# EAGLE design LDAQ-MOD-IO40 (EAGLE 6.6.0)
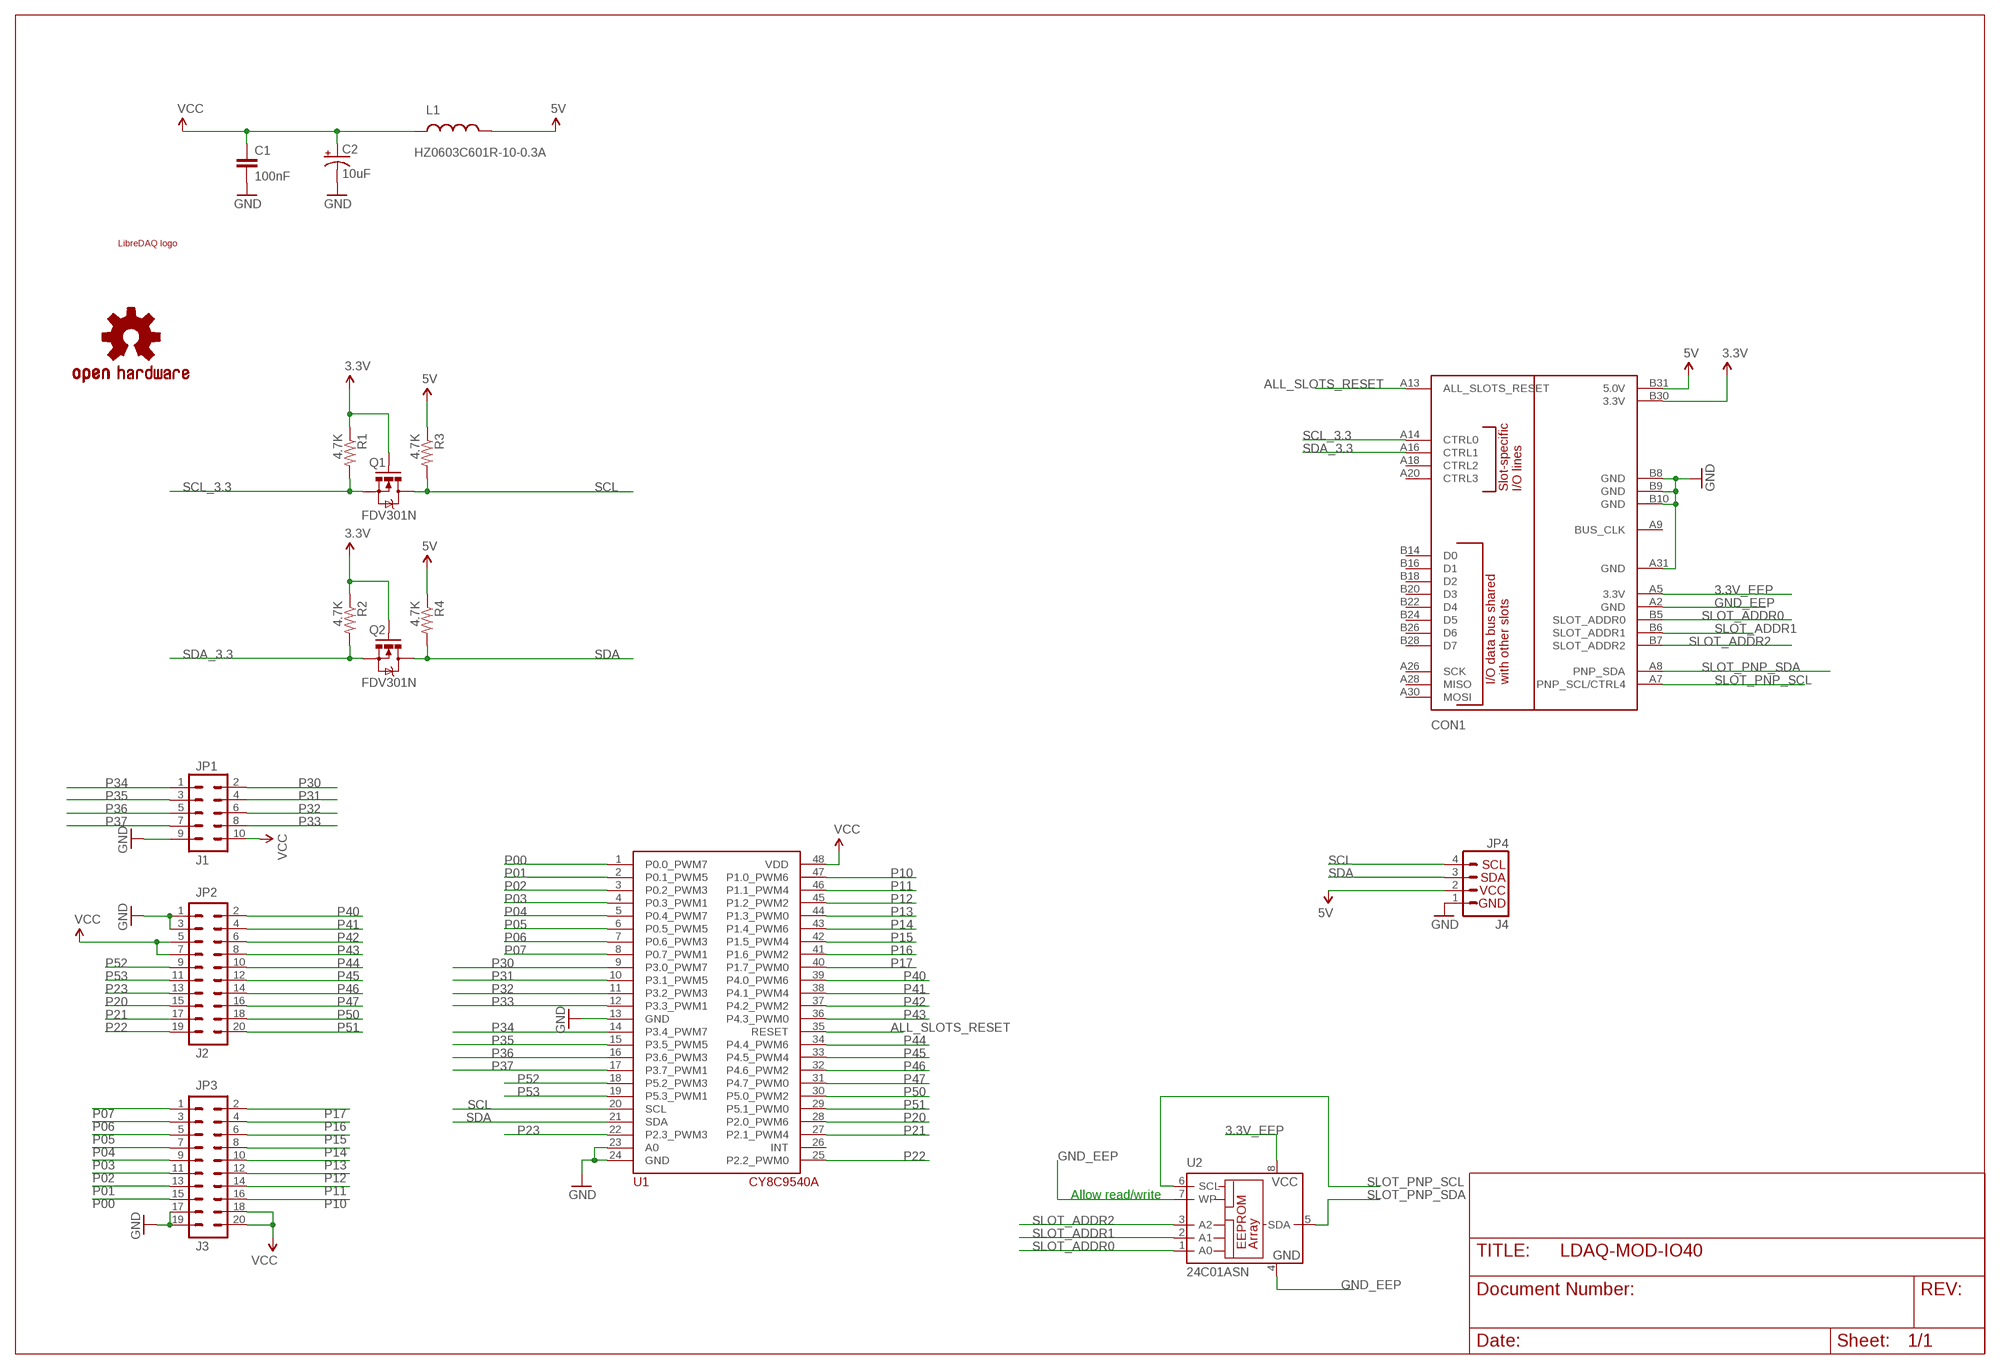
[diagram p0: schematic, sheet 1]

## Parts
C1  100nF  CAP0603-CAP  [0603-CAP]
C2  10uF  CAP_POL1206  [EIA3216]
CON1  C1  LIBREDAQ_DAUGHTER_BOARDPCI-64-SIZE1-PADS  [PCI-E_64_EDGE_70X60_PADS-ONLY]
JP1  J1  M05X2SHD  [2X5-SHROUDED]
JP2  J2  M10X22X10-SHROUDED  [2X10-SHROUDED]
JP3  J3  M10X22X10-SHROUDED  [2X10-SHROUDED]
JP4  J4  I2C_STANDARD  [1X04]
L1  HZ0603C601R-10-0.3A  INDUCTOR0603  [0603]
LOGO1  LIBREDAQ_LOGO_MINILOGO_GENERIC  [LIBREDAQ_LOGO]
LOGO2  OSHW-LOGOM  [OSHW-LOGO-M]
Q1  FDV301N  MOSFET-NCHANNELSMD  [SOT23-3]
Q2  FDV301N  MOSFET-NCHANNELSMD  [SOT23-3]
R1  4.7K  RESISTOR0603-RES  [0603-RES]
R2  4.7K  RESISTOR0603-RES  [0603-RES]
R3  4.7K  RESISTOR0603-RES  [0603-RES]
R4  4.7K  RESISTOR0603-RES  [0603-RES]
U1  CY8C9540A  [SSOP-48]
U2  24C01ASN  [SO-08]

## Nets
3.3V: CON1.B30(3.3V) Q1.1(G) Q2.1(G) R1.1 R2.1
3.3V_EEP: CON1.A5(3.3V) U2.8(VCC)
5V: CON1.B31(5.0V) JP4.2 L1.2 R3.1 R4.1
ALL_SLOTS_RESET: CON1.A13(ALL_SLOTS_RESET) U1.35(RESET)
GND: C1.2 C2.C(-) CON1.A31(GND) CON1.B8(GND) CON1.B9(GND) CON1.B10(GND) JP1.9 JP2.1 JP2.3 JP3.17 JP3.19 JP4.1 U1.13(GND) U1.23(A0) U1.24(GND)
GND_EEP: CON1.A2(GND) U2.4(GND) U2.7(WP)
P00: JP3.15 U1.1(P0.0_PWM7)
P01: JP3.13 U1.2(P0.1_PWM5)
P02: JP3.11 U1.3(P0.2_PWM3)
P03: JP3.9 U1.4(P0.3_PWM1)
P04: JP3.7 U1.5(P0.4_PWM7)
P05: JP3.5 U1.6(P0.5_PWM5)
P06: JP3.3 U1.7(P0.6_PWM3)
P07: JP3.1 U1.8(P0.7_PWM1)
P10: JP3.16 U1.47(P1.0_PWM6)
P11: JP3.14 U1.46(P1.1_PWM4)
P12: JP3.12 U1.45(P1.2_PWM2)
P13: JP3.10 U1.44(P1.3_PWM0)
P14: JP3.8 U1.43(P1.4_PWM6)
P15: JP3.6 U1.42(P1.5_PWM4)
P16: JP3.4 U1.41(P1.6_PWM2)
P17: JP3.2 U1.40(P1.7_PWM0)
P20: JP2.15 U1.28(P2.0_PWM6)
P21: JP2.17 U1.27(P2.1_PWM4)
P22: JP2.19 U1.25(P2.2_PWM0)
P23: JP2.13 U1.22(P2.3_PWM3)
P30: JP1.2 U1.9(P3.0_PWM7)
P31: JP1.4 U1.10(P3.1_PWM5)
P32: JP1.6 U1.11(P3.2_PWM3)
P33: JP1.8 U1.12(P3.3_PWM1)
P34: JP1.1 U1.14(P3.4_PWM7)
P35: JP1.3 U1.15(P3.5_PWM5)
P36: JP1.5 U1.16(P3.6_PWM3)
P37: JP1.7 U1.17(P3.7_PWM1)
P40: JP2.2 U1.39(P4.0_PWM6)
P41: JP2.4 U1.38(P4.1_PWM4)
P42: JP2.6 U1.37(P4.2_PWM2)
P43: JP2.8 U1.36(P4.3_PWM0)
P44: JP2.10 U1.34(P4.4_PWM6)
P45: JP2.12 U1.33(P4.5_PWM4)
P46: JP2.14 U1.32(P4.6_PWM2)
P47: JP2.16 U1.31(P4.7_PWM0)
P50: JP2.18 U1.30(P5.0_PWM2)
P51: JP2.20 U1.29(P5.1_PWM0)
P52: JP2.9 U1.18(P5.2_PWM3)
P53: JP2.11 U1.19(P5.3_PWM1)
SCL: JP4.4 Q1.3(D) R3.2 U1.20(SCL)
SCL_3.3: CON1.A14(CTRL0) Q1.2(S) R1.2
SDA: JP4.3 Q2.3(D) R4.2 U1.21(SDA)
SDA_3.3: CON1.A16(CTRL1) Q2.2(S) R2.2
SLOT_ADDR0: CON1.B5(SLOT_ADDR0) U2.1(A0)
SLOT_ADDR1: CON1.B6(SLOT_ADDR1) U2.2(A1)
SLOT_ADDR2: CON1.B7(SLOT_ADDR2) U2.3(A2)
SLOT_PNP_SCL: CON1.A7(PNP_SCL/CTRL4) U2.6(SCL)
SLOT_PNP_SDA: CON1.A8(PNP_SDA) U2.5(SDA)
VCC: C1.1 C2.A(+) JP1.10 JP2.5 JP2.7 JP3.18 JP3.20 L1.1 U1.48(VDD)
Unconnected: CON1.A9(BUS_CLK) CON1.A18(CTRL2) CON1.A20(CTRL3) CON1.A26(SCK) CON1.A28(MISO) CON1.A30(MOSI) CON1.B14(D0) CON1.B16(D1) CON1.B18(D2) CON1.B20(D3) CON1.B22(D4) CON1.B24(D5) CON1.B26(D6) CON1.B28(D7) U1.26(INT)

## Notes on the sheet
- Allow read/write

## Library data of the parts
C1 = SparkFun-Passives:CAP: Capacitor Standard 0603 ceramic capacitor, and 0.1" leaded capacitor.
C2 = SparkFun-Capacitors:CAP_POL: Capacitor Polarized These are standard SMD and PTH capacitors. Normally 10uF, 47uF, and 100uF in electrolytic and tantalum varieties. Always verify the external diameter of the through hole cap, it varies with capacity, voltage, and manufacturer. The EIA devices should be standard.
CON1 = libredaq-comps:LIBREDAQ_DAUGHTER_BOARD: LibreDAQ Expansion board (PCI-E form)
JP1 = libredaq-comps:M05X2: Header 5x2 Standard 10-pin dual row 0.1" header. Commonly used with AVR-ISP. Use with Spark Fun Electronics SKU: PRT-00778
JP2 JP3 = libredaq-comps:M10X2: This was SPECIALLY designed to be used with our Graphic LCD Backpack. Be sure you want to use this! It is not only staggered on each line of header holes, but IT IS ALSO offset of the center point of the top and bottom lines by 5 mil. This causes the headers to lock into place on the "standard" footprint on the LCD screen. The extra squares on the tdocu layer are there simply to reference other pins (if you were to actually populate a longer header than ten long - this is what we do with the backpacks).
JP4 = SparkFun-Connectors:I2C_STANDARD: SparkFun has standardized on a pinout for all I2C based sensor breakouts. This pinout allows I2C boards to be plugged directly into the headers on Arduino Uno compatible boards, and to be daisy chained easily.
L1 = SparkFun-Passives:INDUCTOR: Inductors Basic Inductor/Choke - 0603 and 1206. Footprints are not proven and vary greatly between part numbers. SRN6045- 33uH, 20% 1.4A SDR0403-560KL - 56uH, 10%, 500mA RMS/740mA peak
LOGO1 = libredaq-comps:LIBREDAQ_LOGO_MINI
LOGO2 = SparkFun-Aesthetics:OSHW-LOGO: Open Source Hardware Logo This logo indicates the piece of hardware it is found on incorporates a OSHW license and/or adheres to the definition of open source hardware found here: http://freedomdefined.org/OSHW
Q1 Q2 = SparkFun:MOSFET-NCHANNEL
R1-R4 = SparkFun:RESISTOR: Resistor Basic schematic elements and footprints for 0603, 1206, and PTH resistors.
U1 = libredaq-comps:CY8C9540A: The CY8C95xxA is a multi-port I/O expander with on board user available EEPROM and several PWM outputs. All devices in this family operate identically but differ in I/O pins, number of PWMs, and internal EEPROM size.
U2 = libredaq-comps:24C*: Serial EEPROM 1 K/2 K/4 K; MPN: AT24C01BN-SH-B; OC_FARNELL: 1362638; OC_NEWARK: 50M3313

## Board
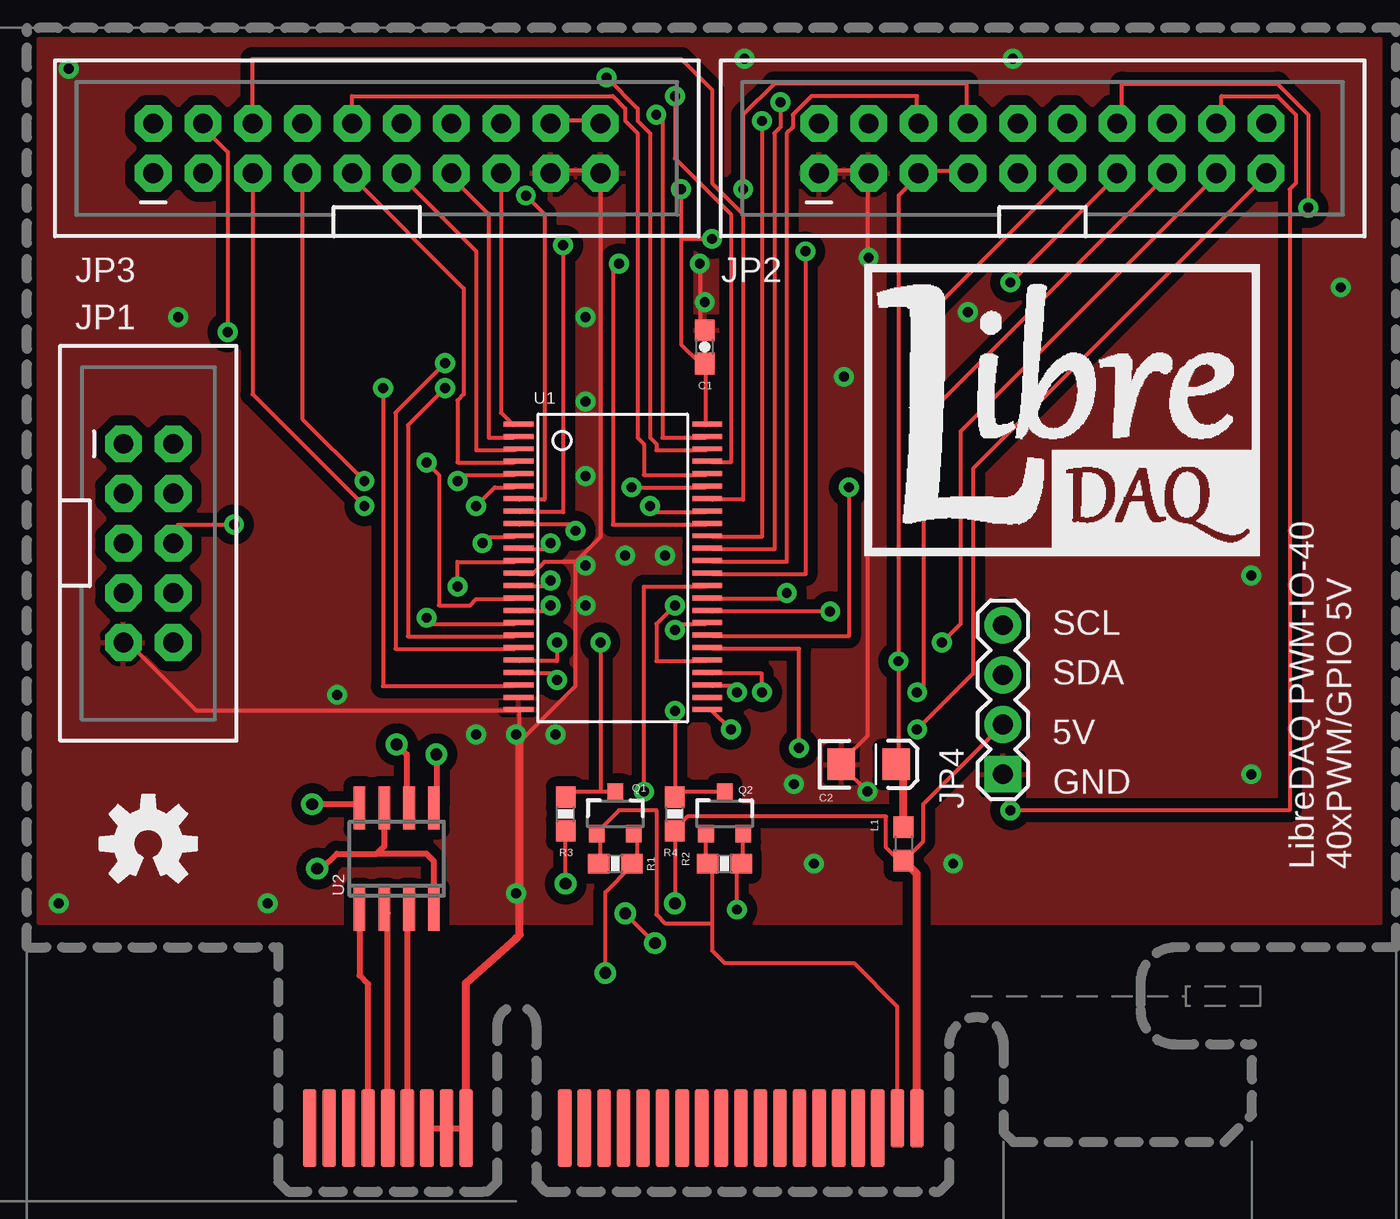
[diagram p1: board, top side]
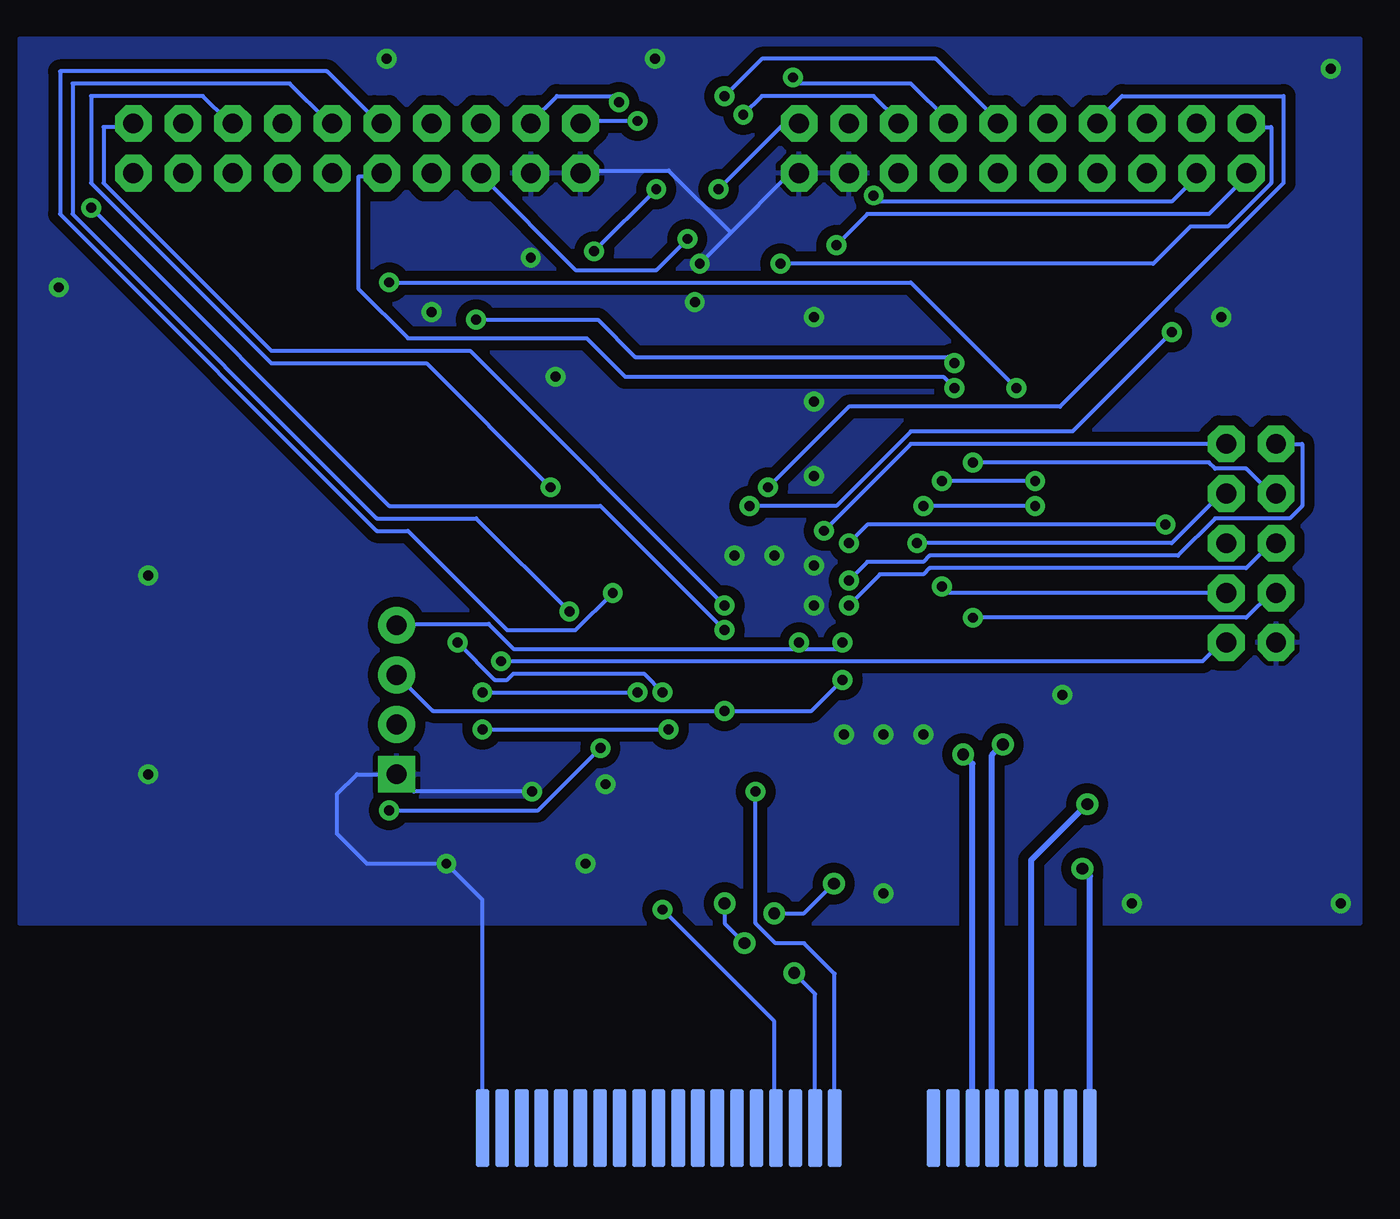
[diagram p2: board, bottom side, seen from below]

No outline drawn. Coordinates in mm, seen from the top.
Copper layers (1*16): Top 0.035mm / dielectric 1.5mm / Bottom 0.035mm
Design rules "LibreDAQ": minimum track width 8mil, minimum drill 20mil, track to track 8mil, track to pad 7mil, pad to pad 7mil, via to via 8mil, smd to smd 7mil, copper to edge 6mil, drill to drill 8mil, minimum pad ring 12mil, minimum via ring 10mil, stop-mask expansion 4mil, vias tented up to drill 25mil, thermal gap 10mil

### Footprints (pad centres in the part's own frame; a part is rotated, then mirrored left to right if it is on the bottom)
0603-CAP = smd 1.1 x 1: 1 -0.85,0; 2 0.85,0
EIA3216 = smd 1.4 x 1.6: A 1.4,0; C -1.4,0
PCI-E_64_EDGE_70X60_PADS-ONLY = smd 0.7 x 4 bottom: A2 -10.55,3.75; A3 -9.55,3.75; A4 -8.55,3.75; A5 -7.55,3.75; A6 -6.55,3.75; A7 -5.55,3.75; A8 -4.55,3.75; A9 -3.55,3.75; A10 -2.55,3.75; A13 2.5,3.75; A14 3.5,3.75; A15 4.5,3.75; A16 5.5,3.75; A17 6.5,3.75; A18 7.5,3.75; A19 8.5,3.75; A20 9.5,3.75; A21 10.5,3.75; A22 11.5,3.75; A23 12.5,3.75; A24 13.5,3.75; A25 14.5,3.75; A26 15.5,3.75; A27 16.5,3.75; A28 17.5,3.75; A29 18.5,3.75; A30 19.5,3.75; A31 20.5,3.75 | smd 0.7 x 4: B2 -10.55,3.75; B3 -9.55,3.75; B4 -8.55,3.75; B5 -7.55,3.75; B6 -6.55,3.75; B7 -5.55,3.75; B8 -4.55,3.75; B9 -3.55,3.75; B10 -2.55,3.75; B13 2.5,3.75; B14 3.5,3.75; B15 4.5,3.75; B16 5.5,3.75; B17 6.5,3.75; B18 7.5,3.75; B19 8.5,3.75; B20 9.5,3.75; B21 10.5,3.75; B22 11.5,3.75; B23 12.5,3.75; B24 13.5,3.75; B25 14.5,3.75; B26 15.5,3.75; B27 16.5,3.75; B28 17.5,3.75; B29 18.5,3.75 | smd 0.7 x 3: B30 19.5,4.25; B31 20.5,4.25
2X5-SHROUDED = drill 1.016 pad 1.88 octagon: 1 -1.27,5.08; 2 1.27,5.08; 3 -1.27,2.54; 4 1.27,2.54; 5 -1.27,0; 6 1.27,0; 7 -1.27,-2.54; 8 1.27,-2.54; 9 -1.27,-5.08; 10 1.27,-5.08
2X10-SHROUDED = drill 1.016 pad 1.88 octagon: 1 -1.27,11.43; 2 1.27,11.43; 3 -1.27,8.89; 4 1.27,8.89; 5 -1.27,6.35; 6 1.27,6.35; 7 -1.27,3.81; 8 1.27,3.81; 9 -1.27,1.27; 10 1.27,1.27; 11 -1.27,-1.27; 12 1.27,-1.27; 13 -1.27,-3.81; 14 1.27,-3.81; 15 -1.27,-6.35; 16 1.27,-6.35; 17 -1.27,-8.89; 18 1.27,-8.89; 19 -1.27,-11.43; 20 1.27,-11.43
1X04 = drill 1.016 pad 1.88 square: 1 0,0 | drill 1.016 pad 1.88: 2 2.54,0; 3 5.08,0; 4 7.62,0
0603 = smd 1.1 x 1: 1 -0.85,0; 2 0.85,0
SOT23-3 = smd 0.8 x 0.9: 1 -0.95,-1; 2 0.95,-1; 3 0,1.1
0603-RES = smd 1.1 x 1: 1 -0.85,0; 2 0.85,0
SSOP-48 = smd 0.254 x 1.524: 1 0,-4.826; 2 0.635,-4.826; 3 1.27,-4.826; 4 1.905,-4.826; 5 2.54,-4.826; 6 3.175,-4.826; 7 3.81,-4.826; 8 4.445,-4.826; 9 5.08,-4.826; 10 5.715,-4.826; 11 6.35,-4.826; 12 6.985,-4.826; 13 7.62,-4.826; 14 8.255,-4.826; 15 8.89,-4.826; 16 9.525,-4.826; 17 10.16,-4.826; 18 10.795,-4.826; 19 11.43,-4.826; 20 12.065,-4.826; 21 12.7,-4.826; 22 13.335,-4.826; 23 13.97,-4.826; 24 14.605,-4.826; 25 14.605,4.826; 26 13.97,4.826; 27 13.335,4.826; 28 12.7,4.826; 29 12.065,4.826; 30 11.43,4.826; 31 10.795,4.826; 32 10.16,4.826; 33 9.525,4.826; 34 8.89,4.826; 35 8.255,4.826; 36 7.62,4.826; 37 6.985,4.826; 38 6.35,4.826; 39 5.715,4.826; 40 5.08,4.826; 41 4.445,4.826; 42 3.81,4.826; 43 3.175,4.826; 44 2.54,4.826; 45 1.905,4.826; 46 1.27,4.826; 47 0.635,4.826; 48 0,4.826
SO-08 = smd 0.6 x 2.2: 1 -1.905,-2.6; 2 -0.635,-2.6; 3 0.635,-2.6; 4 1.905,-2.6; 5 1.905,2.6; 6 0.635,2.6; 7 -0.635,2.6; 8 -1.905,2.6

### Placement (x,y rotation side)
C1  34.54,43.69 90 top
C2  42.93,22.35 0 top
CON1  24.89,0 0 top
JP1  6.1,33.66 0 top
JP2  51.82,53.85 90 top
JP3  17.78,53.85 90 top
JP4  49.78,21.84 90 top
L1  44.7,18.29 270 top
LOGO1  42.67,33.02 0 top
LOGO2  6.1,18.29 0 top
Q1  29.97,19.81 0 top
Q2  35.56,19.81 0 top
R1  29.97,17.27 0 top
R2  35.56,17.27 0 top
R3  27.43,19.81 90 top
R4  33.02,19.81 90 top
U1  29.84,39.75 270 top
U2  18.8,17.53 0 top

### Tracks (layer width: path | path; a pad name or v marks a point on that pad's centre or on a via)
3.3V
  Top 0.203: R1.1 29.21,17.46 29.21,18.73 Q1.1 29.21,19.05 30.16,20 32.07,20 32.07,14.67 32.51,14.22 34.92,14.22 | Q2.1 34.61,18.73 34.61,17.46 R2.1 34.92,17.14 34.92,14.22 | 34.92,14.22 34.92,12.83 35.56,12.19 42.16,12.19 44.39,9.96 CON1.B30
3.3V_EEP  (via drill 0.6)
  Top 0.305: v14.48,20.32 16.7,20.32 U2.8
  Bottom 0.305: CON1.A5 17.34,17.46 v14.48,20.32
5V  (via drill 0.6)
  Top 0.203: 27.3,18.73 R3.1 v27.43,16.26 | JP4.2 45.72,20.32 45.72,18.41 44.77,17.46 L1.2 44.45,17.46 43.81,18.1 43.81,19.68 33.66,19.68 33.02,19.05 R4.1 v33.02,15.24 | v32,13.21 v30.48,14.73
  Top 0.406: CON1.B31 45.39,16.75 L1.2
  Bottom 0.203: v33.02,15.24 33.02,14.22 v32,13.21 | v30.48,14.73 28.96,14.73 v27.43,16.26
ALL_SLOTS_RESET  (via drill 0.51)
  Top 0.203: v31.43,20.95 31.43,31.43 34.61,31.43 U1.35
  Bottom 0.203: v31.43,20.95 31.43,14.22 30.42,13.21 28.96,13.21 27.39,11.64 CON1.A13
GND  (via drill 0.51)
  Top 0.203: 27.94,32.7 26.35,32.7 25.72,32.07 25.08,32.07 U1.13 | 27.94,32.7 27.94,26.35 25.08,23.5 25.08,25.08 U1.24 24.77,25.08 8.57,25.08 5.08,28.57 JP1.9 | v34.29,47.94 34.29,44.77 C1.2 | JP3.17 26.67,52.7 29.21,52.7 JP3.19 29.21,33.97 27.94,32.7 | JP2.1 40.64,52.7 42.86,52.7 JP2.3 42.86,52.39 42.86,23.81 41.59,22.54 C2.C 41.59,22.23 v42.86,20.95
  Top 0.305: CON1.B8 CON1.B9 CON1.B10
  Top 0.406: CON1.B10 22.34,11.17 24.89,13.46 25.08,13.65 25.08,23.5
  Bottom 0.203: 49.85,21.59 JP4.1 | CON1.A31 45.4,3.81 45.4,15.43 v47.24,17.27 51.31,17.27 52.83,18.8 52.83,20.83 51.82,21.84 JP4.1 | 32.7,49.53 29.84,52.39 29.21,52.39 JP3.19 | 32.7,49.53 v34.29,47.94 | 32.7,49.53 35.88,52.7 40.32,52.7 JP2.1 | JP4.1 48.9,20.95 v42.86,20.95
  other vias: 15.75,25.91 24.89,23.88 28.45,37.08 34.54,45.97 41.66,42.16 62.48,21.84 67.06,46.74 40.13,17.27 24.89,15.75 7.62,45.21 2.03,57.91 36.58,58.42 50.29,58.42 32.51,33.02 30.48,33.02 28.45,30.48 28.45,32.51 28.45,40.89 28.45,45.21 22.86,23.88 26.92,23.88 39.12,21.34 48.01,45.47 42.93,48.26 62.48,32 1.52,15.24 12.19,15.24
  pour Top (isolate 0.508): 0.51,59.44 69.09,59.44 69.09,14.22 0.51,14.22
  pour Bottom (isolate 0.508): 0.51,59.44 69.09,59.44 69.09,14.22 0.51,14.22
GND_EEP  (via drill 0.6)
  Top 0.305: v14.73,17.02 14.99,17.02 15.75,17.78 17.78,17.78 | U2.7 18.16,18.16 17.78,17.78 | U2.4 20.7,17.4 20.32,17.78 17.78,17.78
  Bottom 0.305: CON1.A2 14.34,16.63 v14.73,17.02
P00
  Top 0.203: JP3.15 24.13,40.32 24.77,39.69 U1.1
P01
  Top 0.203: U1.2 24.77,39.05 23.5,39.05 23.5,50.48 21.59,52.39 JP3.13
P02
  Top 0.203: U1.3 24.77,38.42 22.86,38.42 22.86,48.58 19.05,52.39 JP3.11
P03
  Top 0.203: U1.4 24.77,37.78 21.91,37.78 21.91,40.96 22.23,41.27 22.23,46.67 16.51,52.39 JP3.9
P04  (via drill 0.51)
  Top 0.203: v21.91,36.83 21.91,37.15 24.77,37.15 U1.5 | v17.14,36.83 13.97,40.01 JP3.7
  Bottom 0.203: v17.14,36.83 v21.91,36.83
P05  (via drill 0.51)
  Top 0.203: v22.86,35.56 23.81,36.51 24.77,36.51 U1.6 | v17.14,35.56 11.43,41.27 JP3.5
  Bottom 0.203: v17.14,35.56 v22.86,35.56
P06  (via drill 0.51)
  Top 0.203: v25.4,51.44 26.35,50.48 26.35,35.88 25.08,35.88 U1.7
  Bottom 0.203: v25.4,51.44 25.08,51.12 10.16,51.12 8.89,52.39 JP3.3
P07  (via drill 0.51)
  Top 0.203: v27.3,48.9 27.3,35.24 25.08,35.24 U1.8
  Bottom 0.203: v27.3,48.9 25.72,50.48 8.26,50.48 6.35,52.39 JP3.1
P10  (via drill 0.51)
  Top 0.203: v32.07,55.56 32.38,55.24 32.38,39.05 34.61,39.05 U1.47
  Bottom 0.203: v32.07,55.56 31.11,56.52 25.4,56.52 24.13,55.24 JP3.16
P11  (via drill 0.51)
  Top 0.203: v29.53,57.47 31.11,55.88 31.11,55.24 31.75,54.61 31.75,39.05 32.07,38.73 32.07,38.42 34.61,38.42 U1.46
  Bottom 0.203: v29.53,57.47 29.21,57.15 23.5,57.15 21.59,55.24 JP3.14
P12  (via drill 0.51)
  Top 0.203: v33.02,56.52 33.02,53.34 35.88,50.48 35.88,37.78 34.92,37.78 U1.45
  Bottom 0.203: v33.02,56.52 31.11,58.42 22.23,58.42 19.05,55.24 JP3.12
P13
  Top 0.203: JP3.10 16.51,56.52 29.84,56.52 30.48,55.88 30.48,55.24 31.11,54.61 31.11,39.05 31.43,38.73 31.43,37.15 34.61,37.15 U1.44
P14  (via drill 0.51)
  Top 0.203: v30.8,36.51 34.61,36.51 U1.43
  Bottom 0.203: v30.8,36.51 26.67,40.64 15.88,40.64 4.45,52.07 4.45,56.52 12.7,56.52 13.97,55.24 JP3.8
P15
  Top 0.203: JP3.6 11.43,58.42 33.34,58.42 34.92,56.83 34.92,52.07 36.51,50.48 36.51,35.88 34.92,35.88 U1.42
P16  (via drill 0.51)
  Top 0.203: v31.75,35.56 31.75,35.24 34.61,35.24 U1.41 | v10.16,44.45 10.16,53.66 8.89,54.93 JP3.4
  Bottom 0.203: v31.75,35.56 27.3,35.56 23.5,39.37 15.24,39.37 v10.16,44.45
P17  (via drill 0.51)
  Top 0.203: v30.16,47.94 29.84,47.62 29.84,34.61 34.61,34.61 U1.40
  Bottom 0.203: v30.16,47.94 11.11,47.94 9.21,49.85 7.3,49.85 5.08,52.07 5.08,54.93 6.35,54.93 JP3.2
P20  (via drill 0.51)
  Top 0.203: v37.47,26.04 37.47,26.99 34.92,26.99 U1.28 | v45.4,26.04 45.72,26.35 45.72,40.01 58.1,52.39 JP2.15
  Bottom 0.203: v45.4,26.04 v37.47,26.04
P21  (via drill 0.51)
  Top 0.203: v36.2,26.04 36.2,26.35 34.92,26.35 U1.27 | v46.67,28.57 47.62,29.53 47.62,39.37 60.64,52.39 JP2.17
  Bottom 0.203: v36.2,26.04 37.15,26.99 43.81,26.99 44.13,26.67 44.77,26.67 v46.67,28.57
P22  (via drill 0.51)
  Top 0.203: v35.88,24.13 34.92,25.08 U1.25 | v45.4,24.13 48.26,26.99 48.26,37.47 63.18,52.39 JP2.19
  Bottom 0.203: v45.4,24.13 v35.88,24.13
P23  (via drill 0.51)
  Top 0.203: v18.1,41.59 18.1,26.35 24.77,26.35 U1.22 | v50.16,46.99 55.56,52.39 JP2.13
  Bottom 0.203: v18.1,41.59 23.5,46.99 v50.16,46.99
P30  (via drill 0.51)
  Top 0.203: v27.94,34.29 27.94,34.61 25.08,34.61 U1.9
  Bottom 0.203: v27.94,34.29 23.5,38.73 JP1.2
P31  (via drill 0.51)
  Top 0.203: v23.18,33.66 23.18,33.97 24.77,33.97 U1.10
  Bottom 0.203: v23.18,33.66 10.16,33.66 7.62,36.2 JP1.4
P32  (via drill 0.51)
  Top 0.203: v26.67,33.66 26.67,33.34 25.08,33.34 U1.11 | v10.48,34.61 7.62,34.61 7.62,33.66 JP1.6
  Bottom 0.203: v26.67,33.66 25.72,34.61 v10.48,34.61
P33  (via drill 0.51)
  Top 0.203: v21.91,31.43 21.91,32.7 24.77,32.7 U1.12
  Bottom 0.203: v21.91,31.43 21.59,31.11 JP1.8
P34  (via drill 0.51)
  Top 0.203: v26.67,31.75 26.67,31.43 25.08,31.43 U1.14
  Bottom 0.203: v26.67,31.75 25.72,32.7 22.86,32.7 22.54,33.02 9.84,33.02 7.94,34.92 4.13,34.92 3.49,35.56 3.49,38.73 JP1.1
P35  (via drill 0.51)
  Top 0.203: v20.32,37.78 20.95,37.15 20.95,30.48 22.54,30.48 22.86,30.8 24.77,30.8 U1.15
  Bottom 0.203: v20.32,37.78 8.26,37.78 7.94,37.47 6.35,37.47 5.08,36.2 JP1.3
P36  (via drill 0.51)
  Top 0.203: v26.67,30.48 26.67,30.16 25.08,30.16 U1.16
  Bottom 0.203: v26.67,30.48 25.08,32.07 22.86,32.07 22.54,32.38 6.35,32.38 5.08,33.66 JP1.5
P37  (via drill 0.51)
  Top 0.203: v20.32,29.84 20.32,29.53 24.77,29.53 U1.17
  Bottom 0.203: v20.32,29.84 6.35,29.84 5.08,31.11 JP1.7
P40  (via drill 0.51)
  Top 0.203: v37.47,55.24 37.47,33.97 34.92,33.97 U1.39
  Bottom 0.203: v37.47,55.24 40.32,55.24 JP2.2
P41  (via drill 0.51)
  Top 0.203: v38.42,56.2 38.42,54.93 38.1,54.61 38.1,33.34 34.92,33.34 U1.38
  Bottom 0.203: v38.42,56.2 38.73,56.52 41.59,56.52 42.86,55.24 JP2.4
P42
  Top 0.203: U1.37 34.92,32.7 38.73,32.7 38.73,54.61 39.05,54.93 39.05,55.56 40.01,56.52 45.4,56.52 45.4,55.24 JP2.6
P43  (via drill 0.51)
  Top 0.203: v39.69,48.58 39.69,32.07 34.92,32.07 U1.36 | v36.51,51.75 36.51,55.56 38.1,57.15 47.94,57.15 47.94,55.24 JP2.8
  Bottom 0.203: v36.51,51.75 v39.69,48.58
P44  (via drill 0.51)
  Top 0.203: v38.73,31.11 38.73,30.8 34.92,30.8 U1.34
  Bottom 0.203: v38.73,31.11 40.64,29.21 44.13,29.21 49.21,34.29 50.8,34.29 66.99,50.48 66.99,57.78 53.34,57.78 50.8,55.24 JP2.10
P45  (via drill 0.51)
  Top 0.203: v40.96,30.16 34.92,30.16 U1.33
  Bottom 0.203: v40.96,30.16 45.72,34.92 50.8,34.92 66.36,50.48 66.36,57.15 55.24,57.15 53.34,55.24 JP2.12
P46  (via drill 0.51)
  Top 0.203: v33.02,29.21 33.02,29.53 34.61,29.53 U1.32 | v65.41,50.8 65.41,55.56 63.82,57.15 55.88,57.15 55.88,55.24 JP2.14
  Bottom 0.203: v33.02,29.21 39.37,35.56 50.16,35.56 v65.41,50.8
P47  (via drill 0.51)
  Top 0.203: v41.91,36.51 41.91,28.89 34.92,28.89 U1.31
  Bottom 0.203: v41.91,36.51 48.26,42.86 56.2,42.86 65.41,52.07 65.41,56.52 59.69,56.52 58.42,55.24 JP2.16
P50  (via drill 0.51)
  Top 0.203: v39.37,23.18 39.37,28.26 34.92,28.26 U1.30 | v50.16,20 64.45,20 64.45,51.75 64.77,52.07 64.77,55.56 63.82,56.52 60.96,56.52 60.96,55.24 JP2.18
  Bottom 0.203: v39.37,23.18 42.55,20 v50.16,20
P51  (via drill 0.51)
  Top 0.203: v33.02,30.48 32.07,29.53 32.07,27.62 34.61,27.62 U1.29
  Bottom 0.203: v33.02,30.48 46.04,43.5 56.2,43.5 64.77,52.07 64.77,54.93 63.5,54.93 JP2.20
P52  (via drill 0.51)
  Top 0.203: v21.27,41.59 19.37,39.69 19.37,28.89 24.77,28.89 U1.18
  Bottom 0.203: v21.27,41.59 21.84,42.16 38.1,42.16 40.07,44.13 49.21,44.13 51.75,46.67 51.75,52.39 50.8,52.39 JP2.9
P53  (via drill 0.51)
  Top 0.203: v21.27,42.86 18.73,40.32 18.73,28.26 24.77,28.26 U1.19 | v45.72,45.09 53.02,52.39 JP2.11
  Bottom 0.203: v45.72,45.09 39.5,45.09 37.59,43.18 21.59,43.18 v21.27,42.86
SCL  (via drill 0.51)
  Top 0.203: 29.21,20.95 27.62,20.95 R3.2 | 29.21,20.95 29.84,20.95 Q1.3 | v26.99,28.57 26.99,27.62 25.08,27.62 U1.20 | v29.21,28.57 29.21,20.95
  Bottom 0.203: v26.99,28.57 27.3,28.26 29.21,28.26 | 29.21,28.26 43.81,28.26 45.09,29.53 49.53,29.53 JP4.4 | 29.21,28.26 v29.21,28.57
SCL_3.3  (via drill 0.6)
  Top 0.203: Q1.2 31.11,18.73 31.11,17.46 R1.2 30.8,17.14 29.46,15.81 v29.46,11.68
  Bottom 0.203: CON1.A14 28.39,10.61 v29.46,11.68
SDA  (via drill 0.51)
  Top 0.203: 33.02,20.95 35.56,20.95 Q2.3 | v26.99,26.67 26.99,26.99 25.08,26.99 U1.21 | v33.02,25.08 33.02,20.95 | 33.02,20.95 R4.2
  Bottom 0.203: v26.99,26.67 28.57,25.08 v33.02,25.08 47.94,25.08 JP4.3
SDA_3.3  (via drill 0.51)
  Top 0.203: Q2.2 36.51,18.73 36.51,17.46 R2.2 36.2,17.14 v36.2,14.92
  Bottom 0.203: CON1.A16 30.48,3.81 30.48,9.21 v36.2,14.92
SLOT_ADDR0
  Top 0.305: CON1.B5 17.34,11.11 16.89,11.56 U2.1
SLOT_ADDR1
  Top 0.305: CON1.B6 18.34,14.74 U2.2
SLOT_ADDR2
  Top 0.305: CON1.B7 19.34,14.84 U2.3
SLOT_PNP_SCL  (via drill 0.6)
  Top 0.305: v18.8,23.37 19.3,22.86 19.3,20.25 U2.6
  Bottom 0.305: CON1.A7 19.34,22.82 v18.8,23.37
SLOT_PNP_SDA  (via drill 0.6)
  Top 0.305: v20.83,22.86 20.83,20.25 U2.5
  Bottom 0.305: CON1.A8 20.34,22.37 v20.83,22.86
VCC  (via drill 0.51)
  Top 0.203: U1.48 34.61,39.69 34.61,42.55 C1.1 34.29,42.86 33.34,43.81 33.34,49.21 | v33.34,51.75 33.34,49.21 | JP3.18 26.67,55.24 29.21,55.24 JP3.20 | C2.A 44.45,22.54 v44.45,27.62 44.45,51.44 45.4,52.39 JP2.5 45.72,52.7 47.94,52.7 JP2.7 | v34.92,49.21 33.34,49.21
  Top 0.406: L1.1 44.7,21.97 C2.A
  Bottom 0.203: v33.34,51.75 30.16,54.93 29.21,54.93 JP3.20 | v44.45,27.62 8.57,27.62 7.62,28.57 JP1.10 | v34.92,49.21 36.51,47.62 40.64,47.62 45.4,52.39 JP2.5

### Text on the board
tPlace: SCL | SDA | 5V | GND | LibreDAQ PWM-IO-40 / 40xPWM/GPIO 5V